# EAGLE design cond1 (EAGLE 4.15)
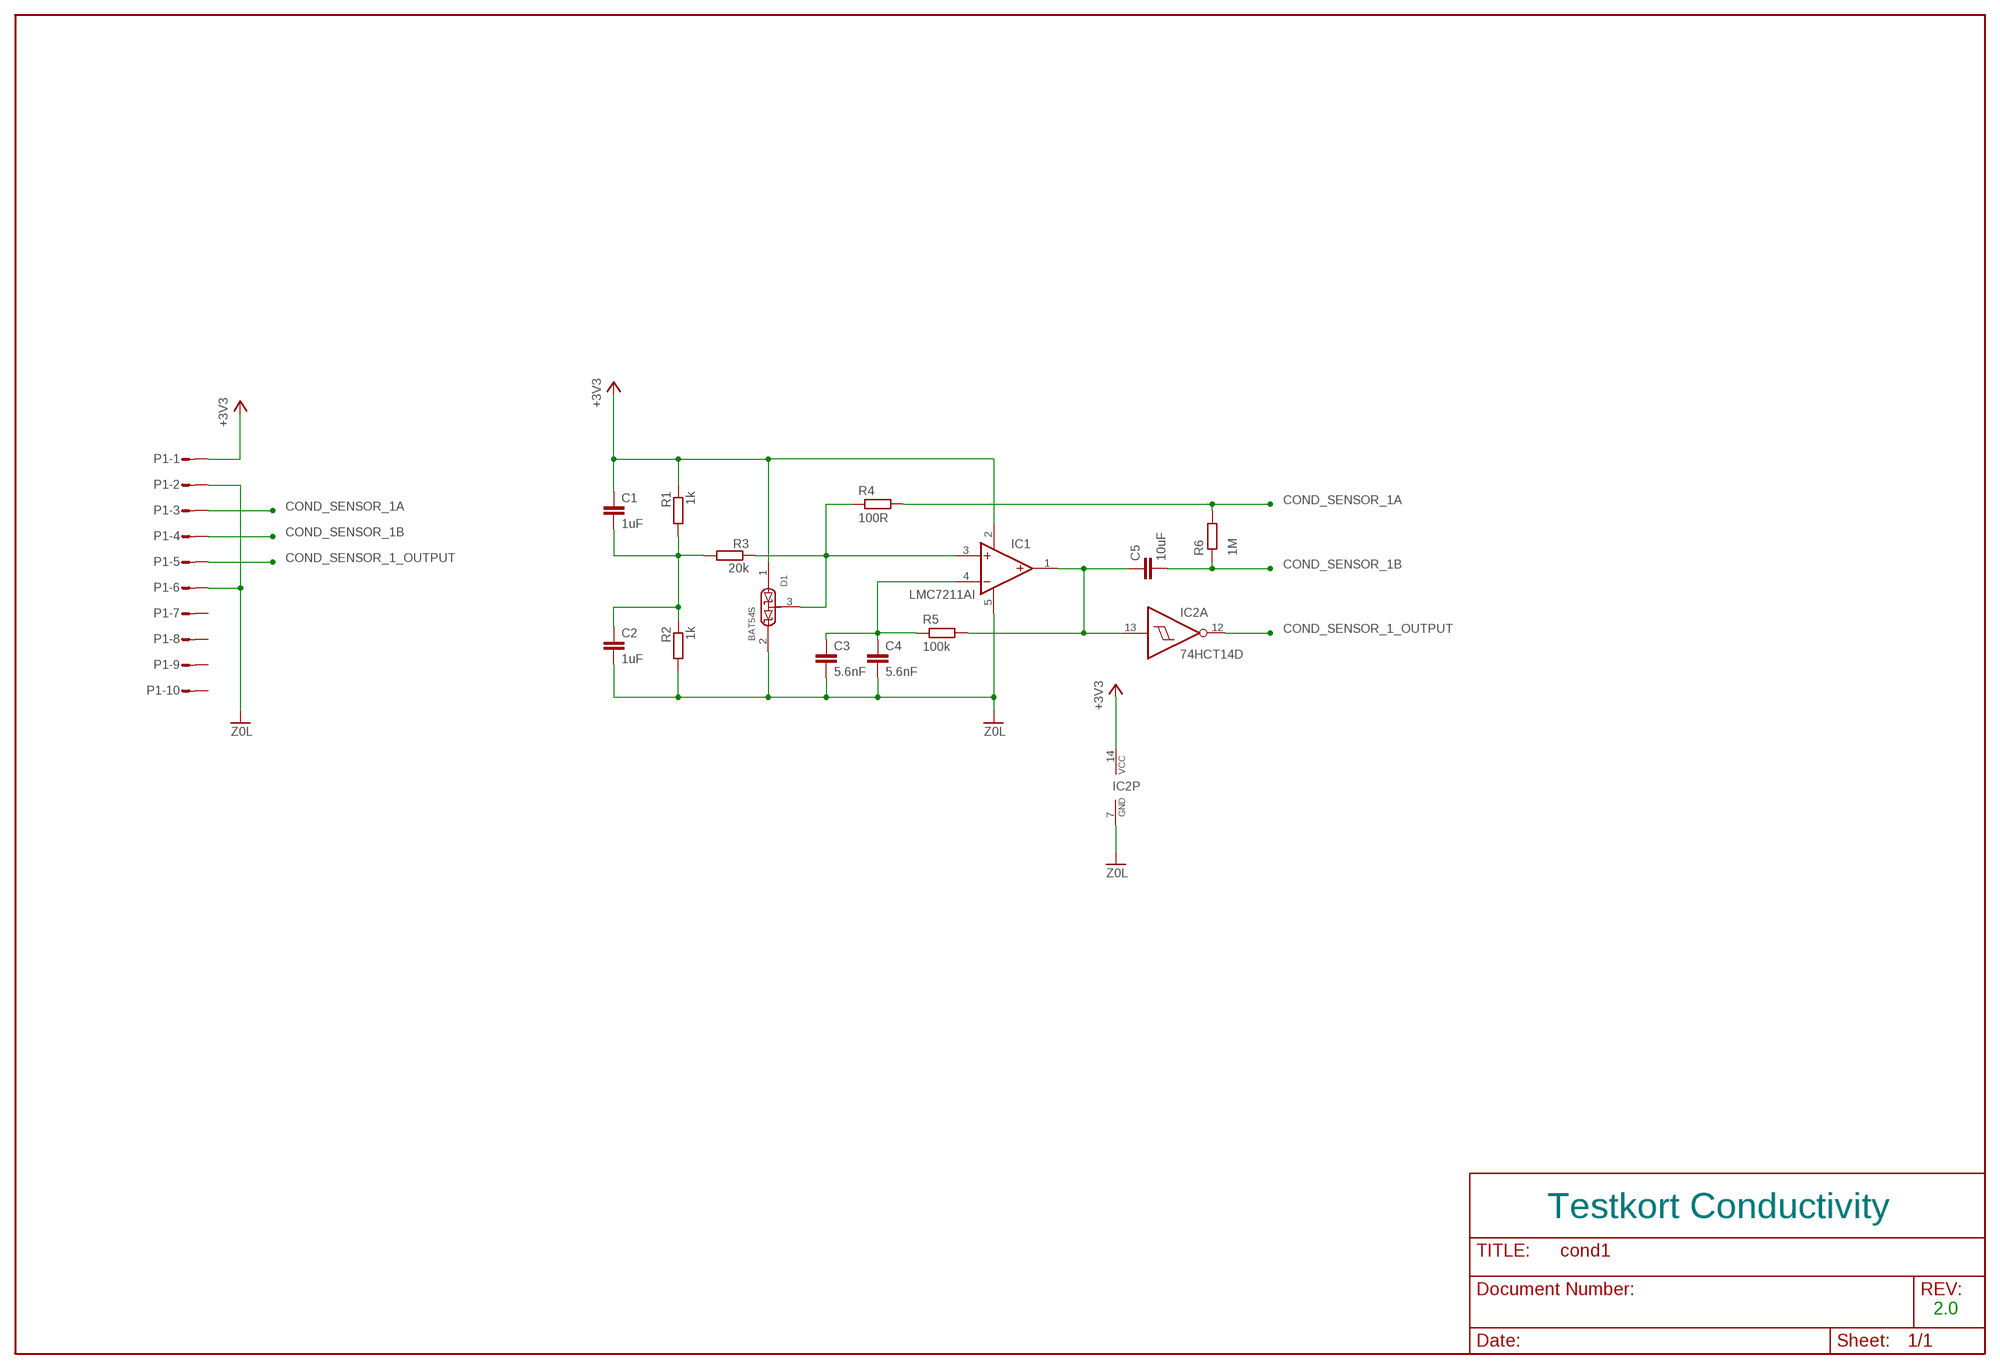
[diagram p0: schematic, sheet 1]

## Parts
C1  1uF  C-EUC0805K  [C0805K]
C2  1uF  C-EUC0805K  [C0805K]
C3  5.6nF  C-EUC0805K  [C0805K]
C4  5.6nF  C-EUC0805K  [C0805K]
C5  10uF  C-EUC1206K  [C1206K]
D1  BAT54S  [SOT23]
IC1  LMC7211AI  [SOT23-5]
IC2  74HCT14D  [SO14]
P1  L10P  [L10P]
R1  1k  R-EU_R0805W  [R0805W]
R2  1k  R-EU_R0805W  [R0805W]
R3  20k  R-EU_R0805W  [R0805W]
R4  100R  R-EU_R0805W  [R0805W]
R5  100k  R-EU_R0805W  [R0805W]
R6  1M  R-EU_R0805W  [R0805W]

## Nets
0V: C2.2 C3.2 C4.2 D1.2 IC1.5(V-) IC2.7(P:GND) P1.2 P1.6 R2.2 ; supply symbol labelled Z0L
+3V3: C1.1 C1.2 C2.1 D1.1 IC1.2(V+) IC2.14(P:VCC) P1.1 R1.1 R1.2 R2.1 R3.2
COND_SENSOR_1_OUTPUT: IC2.12(A:O) P1.5
COND_SENSOR_1A: P1.3 R4.2 R6.2
COND_SENSOR_1B: C5.2 P1.4 R6.1
N$3: C5.1 IC1.1(OUT) IC2.13(A:I) R5.2
N$4: C3.1 C4.1 IC1.4(IN-) R5.1
N$249: D1.3 IC1.3(IN+) R3.1 R4.1
Unconnected: IC2.1(D:I) IC2.2(D:O) IC2.3(E:I) IC2.4(E:O) IC2.5(F:I) IC2.6(F:O) IC2.8(C:O) IC2.9(C:I) IC2.10(B:O) IC2.11(B:I) P1.7 P1.8 P1.9 P1.10

## Notes on the sheet
- Testkort Conductivity
- 2.0

## Library data of the parts
C1-C5 = rcl:C-EU: CAPACITOR, European symbol
D1 = lbm:BAT54S
IC1 = lbm:LMC7211AI
IC2 = 74xx-eu:74*14: Hex schmitt trigger INVERTER
P1 = con-amp-mt:L10P: AMP MT CONNECTOR
R1-R6 = rcl:R-EU_: RESISTOR, European symbol

## Board
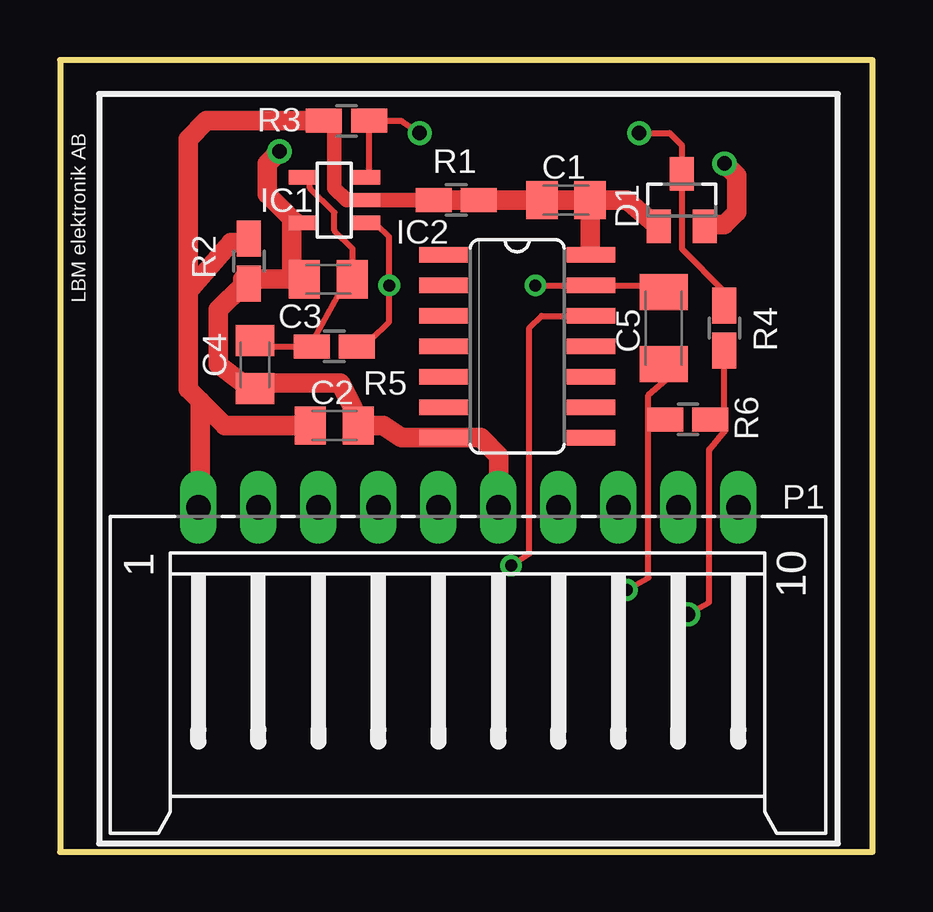
[diagram p1: board, top side]
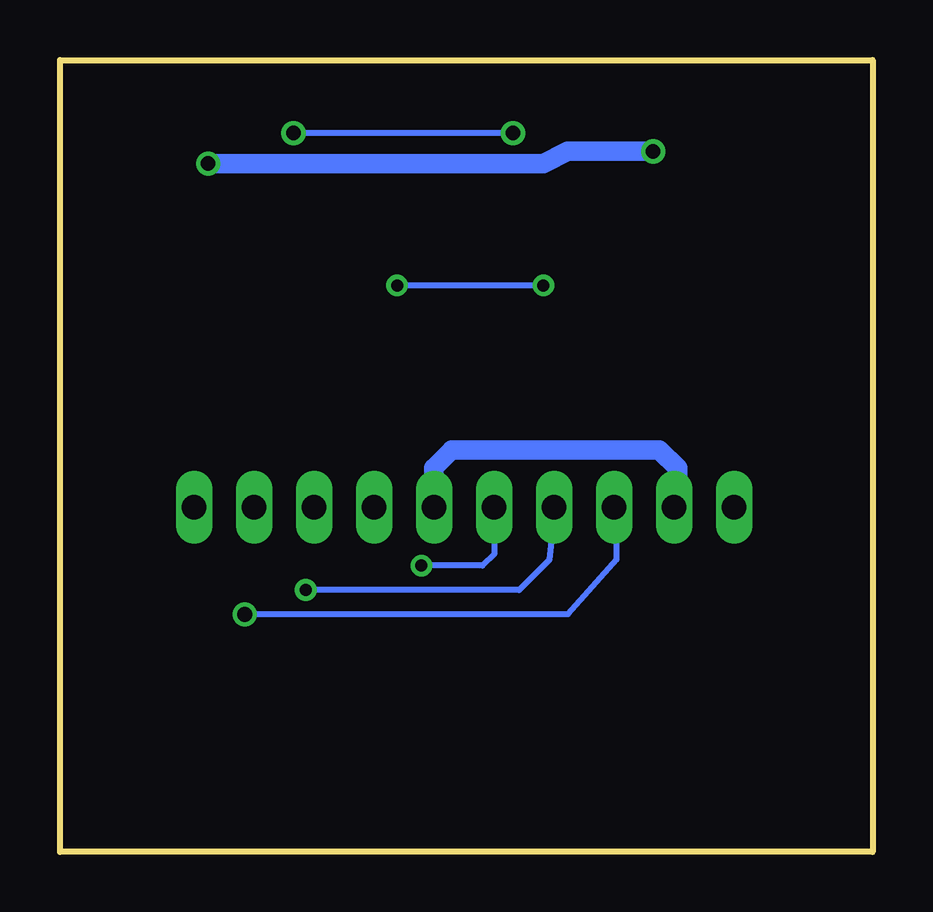
[diagram p2: board, bottom side, seen from below]

Size 33.86 x 33.02 mm. Coordinates in mm from the lower left corner, seen from the top.
Outline: 0,0 33.86,0 33.86,33.02 0,33.02 0,0
Copper layers (1*16): Top 0.035mm / dielectric 1.5mm / Bottom 0.035mm
Design rules "default": minimum track width 8mil, minimum drill 19mil, track to track 10mil, track to pad 10mil, pad to pad 10mil, via to via 10mil, smd to smd 8mil, copper to edge 40mil, drill to drill 8mil, minimum pad ring 10mil, minimum via ring 8mil, stop-mask expansion 4mil, vias tented up to drill 0mil, thermal gap 10mil

### Footprints (pad centres in the part's own frame; a part is rotated, then mirrored left to right if it is on the bottom)
C0805K = smd 1.3 x 1.6: 1 -1,0; 2 1,0
C1206K = smd 1.5 x 2: 1 -1.5,0; 2 1.5,0
SOT23 = smd 1 x 1.4: 1 -0.95,-1.1; 2 0.95,-1.1; 3 0,1.1
SOT23-5 = smd 0.6 x 1.2: 1 -0.95,-1.306; 2 0,-1.306; 3 0.95,-1.306; 4 0.95,1.306; 5 -0.95,1.306
SO14 = smd 0.66 x 2.032: 1 -3.81,-3.073; 2 -2.54,-3.073; 3 -1.27,-3.073; 4 0,-3.073; 5 1.27,-3.073; 6 2.54,-3.073; 7 3.81,-3.073; 8 3.81,3.073; 9 2.54,3.073; 10 1.27,3.073; 11 0,3.073; 12 -1.27,3.073; 13 -2.54,3.073; 14 -3.81,3.073
L10P = drill 1.016 long: 1 11.25,-6.25; 2 8.75,-6.25; 3 6.25,-6.25; 4 3.75,-6.25; 5 1.25,-6.25; 6 -1.25,-6.25; 7 -3.75,-6.25; 8 -6.25,-6.25; 9 -8.75,-6.25; 10 -11.25,-6.25
R0805W = smd 1.5 x 1: 1 -0.94,0; 2 0.94,0

### Placement (x,y rotation side)
C1  21.08,27.18 0 top
C2  11.43,17.78 0 top
C3  11.18,23.88 180 top
C4  8.13,20.32 270 top
C5  25.15,21.84 270 top
D1  25.91,27.18 0 top
IC1  11.43,27.18 90 top
IC2  19.05,21.08 270 top
P1  17.02,8.13 180 top
R1  16.51,27.18 0 top
R2  7.87,24.64 270 top
R3  11.94,30.48 180 top
R4  27.69,21.84 270 top
R5  11.43,21.08 0 top
R6  26.16,18.03 0 top

### Tracks (layer width: path | path; a pad name or v marks a point on that pad's centre or on a via)
0V  (via drill 0.6)
  Top 0.254: IC2.7 16,17.27 | 7.62,19.56 8.13,19.56 C4.2 8.13,19.3 | 7.62,23.62 7.87,23.62 R2.2 7.62,23.88 | 9.8,26.26 10.31,26.16 9.65,26.16 | 9.65,26.16 10.06,26.16 IC1.5 10.16,26.23 9.65,26.16 | 9.65,24.13 10.16,23.88 C3.2 | C2.2 12.45,17.78 12.19,18.54 | P1.6 18.29,14.22 18.27,14.24 P1.6
  Top 0.813: 12.45,17.78 13.46,17.78 14.22,17.27 IC2.7 17.53,17.27 18.29,16.51 18.29,14.22 | 7.62,19.56 6.6,20.32 6.6,22.61 7.62,23.62 | 9.8,26.26 8.64,27.43 8.64,28.7 v9.14,29.21 | 12.19,18.54 11.68,19.56 8.13,19.56 | 7.62,23.88 10.16,23.88 | 9.65,24.13 9.65,26.16 | v27.69,28.7 28.19,28.19 28.19,26.67 27.69,26.16 26.92,26.16 26.86,26.1 D1.2
  Bottom 0.254: 18.29,14.22 18.29,14.36 P1.6 | 8.13,14.48 8.23,14.38 P1.2
  Bottom 0.813: 18.29,14.36 18.29,16 17.53,16.76 8.89,16.76 8.13,16 8.13,14.48 | v27.69,28.7 13.72,28.7 12.7,29.21 v9.14,29.21
+3V3
  Top 0.254: 11.43,30.73 R3.2 11.18,30.48 11.43,30.48 | 11.94,27.18 IC1.2 | 7.62,25.4 R2.1 | 20.07,27.18 C1.1 | 22.1,25.15 IC2.14 | C1.2 22.1,27.18
  Top 0.406: R1.2 17.53,27.18 | P1.1 5.84,14.38
  Top 0.61: IC1.2 R1.1 | 11.94,27.18 11.43,27.69 11.43,30.48
  Top 0.813: 5.33,23.11 5.33,19.3 5.84,18.8 | 5.33,23.11 5.33,23.37 7.11,25.4 7.62,25.4 | C2.1 6.86,17.78 5.84,18.8 | R1.1 R1.2 20.07,27.18 C1.2 | 22.1,25.15 22.1,27.18 23.62,27.18 24.89,26.1 D1.1 | P1.1 5.77,14.3 5.84,14.22 5.84,18.8 | 11.18,30.48 6.1,30.48 5.33,29.72 5.33,23.11
COND_SENSOR_1_OUTPUT  (via drill 0.5 pad 0.25)
  Top 0.254: IC2.12 20.07,22.35 19.56,21.84 19.56,12.45 v18.8,11.94
  Bottom 0.254: v18.8,11.94 16.26,11.94 15.75,12.45 15.75,14.48 P1.5
COND_SENSOR_1A  (via drill 0.61)
  Top 0.254: 26.92,17.78 R6.2 27.43,18.29 27.69,18.29 | 27.69,18.29 R4.2 | v26.16,9.91 27.05,10.41 27.05,16.76 27.69,17.53 27.69,18.29
  Bottom 0.254: v26.16,9.91 12.7,9.91 10.67,12.19 10.67,14.28 P1.3
COND_SENSOR_1B  (via drill 0.5 pad 0.25)
  Top 0.254: 25.65,18.03 R6.1 | 25.4,18.03 25.65,18.03 | v23.62,10.92 24.51,11.43 24.51,18.03 | 25.65,18.03 25.65,17.78 25.4,18.03 | 24.51,18.03 25.4,18.03 | C5.2 25.4,19.81 24.51,19.05 24.51,18.03
  Bottom 0.254: v23.62,10.92 14.73,10.92 13.46,12.19 13.21,14.48 13.27,14.42 P1.4
N$3  (via drill 0.5 pad 0.25)
  Top 0.254: R5.2 12.95,21.34 13.72,22.1 v13.72,23.62 13.72,25.65 13.21,26.16 12.45,26.16 12.51,26.23 IC1.1 | v19.81,23.62 IC2.13 24.38,23.62 25.15,23.37 C5.1
  Bottom 0.254: v13.72,23.62 v19.81,23.62 20.07,23.62
N$4
  Top 0.254: 10.06,28.19 IC1.4 10.16,28.16 10.16,28.19 10.41,28.19 10.41,27.69 11.43,26.67 11.43,25.91 12.19,25.15 12.19,23.88 | 10.41,21.08 R5.1 | 8.64,21.08 8.38,21.59 8.13,21.59 7.87,21.34 | C4.1 7.87,21.34 | 7.87,21.34 8.64,21.08 | 8.64,21.08 10.41,21.08 | 10.41,21.08 11.68,23.37 12.19,23.88 | 12.19,23.88 C3.1
N$249  (via drill 0.6)
  Top 0.254: 13.21,28.13 13.21,28.19 12.7,28.19 | 12.7,28.19 12.88,28.37 R3.1 13.21,30.23 13.21,30.48 14.22,30.48 v14.99,29.97 | 12.7,28.19 12.74,28.16 IC1.3 | 27.69,22.61 R4.1 27.69,23.37 25.91,25.15 D1.3 25.91,29.46 25.4,29.97 v24.13,29.97
  Bottom 0.254: v14.99,29.97 v24.13,29.97

### Text on the board
tNames: LBM elektronik AB